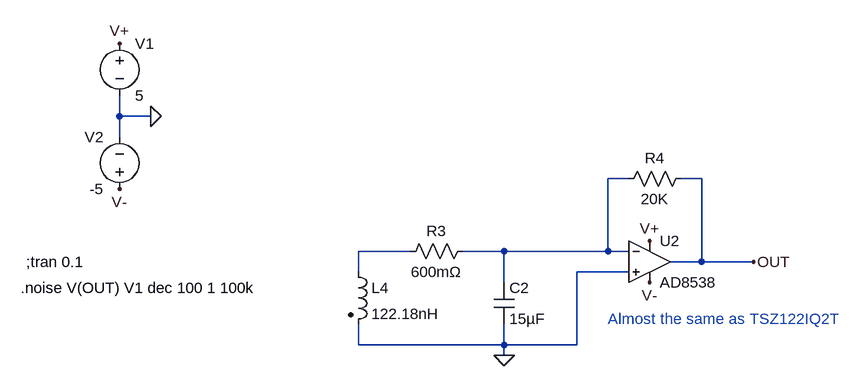
[diagram p0: schematic Rogowski coil noise.asc]
Rogowski coil noise.asc, the LTspice schematic file:
Version 4
SHEET 1 1116 680
WIRE -16 176 -16 144
WIRE 32 176 -16 176
WIRE -16 208 -16 176
WIRE 768 272 736 272
WIRE 880 272 848 272
WIRE 432 384 352 384
WIRE 576 384 512 384
WIRE 736 384 736 272
WIRE 736 384 576 384
WIRE 768 384 736 384
WIRE 880 400 880 272
WIRE 880 400 832 400
WIRE 960 400 880 400
WIRE 352 416 352 384
WIRE 768 416 688 416
WIRE 576 432 576 384
WIRE 352 528 352 496
WIRE 576 528 576 496
WIRE 576 528 352 528
WIRE 688 528 688 416
WIRE 688 528 576 528
WIRE 576 544 576 528
FLAG 32 176 0
FLAG -16 64 V+
FLAG -16 288 V-
FLAG 576 544 0
FLAG 800 368 V+
FLAG 800 432 V-
FLAG 960 400 OUT
SYMBOL voltage -16 48 R0
WINDOW 123 0 0 Left 0
WINDOW 39 0 0 Left 0
SYMATTR InstName V1
SYMATTR Value 5
SYMBOL voltage -16 304 R180
WINDOW 0 24 96 Left 2
WINDOW 3 24 16 Left 2
WINDOW 123 0 0 Left 0
WINDOW 39 0 0 Left 0
SYMATTR InstName V2
SYMATTR Value -5
SYMBOL ind2 336 400 R0
SYMATTR InstName L4
SYMATTR Value 122.18nH
SYMATTR Type ind
SYMBOL res 528 368 R90
WINDOW 0 0 56 VBottom 2
WINDOW 3 32 56 VTop 2
SYMATTR InstName R3
SYMATTR Value 600mΩ
SYMBOL cap 560 432 R0
SYMATTR InstName C2
SYMATTR Value 15µF
SYMBOL res 864 256 R90
WINDOW 0 0 56 VBottom 2
WINDOW 3 32 56 VTop 2
SYMATTR InstName R4
SYMATTR Value 20K
SYMATTR SpiceLine tol=1 pwr=0.1
SYMBOL Opamps\\AD8538 800 336 R0
SYMATTR InstName U2
TEXT -160 400 Left 2 !;tran 0.1
TEXT 736 488 Left 2 ;Almost the same as TSZ122IQ2T
TEXT -168 440 Left 2 !.noise V(OUT) V1 dec 100 1 100k

The netlist it stands for:
* Rogowski coil noise.asc
V1 V+ 0 5
V2 V- 0 -5
L4 N002 0 122.18nH
R3 N001 N002 600mΩ
C2 N001 0 15µF
R4 OUT N001 20K tol=1 pwr=0.1
XU2 0 N001 V+ V- OUT AD8538  ; pins In+ In- V+ V- OUT
;tran 0.1
* Almost the same as TSZ122IQ2T
.noise V(OUT) V1 dec 100 1 100k
.backanno
.end